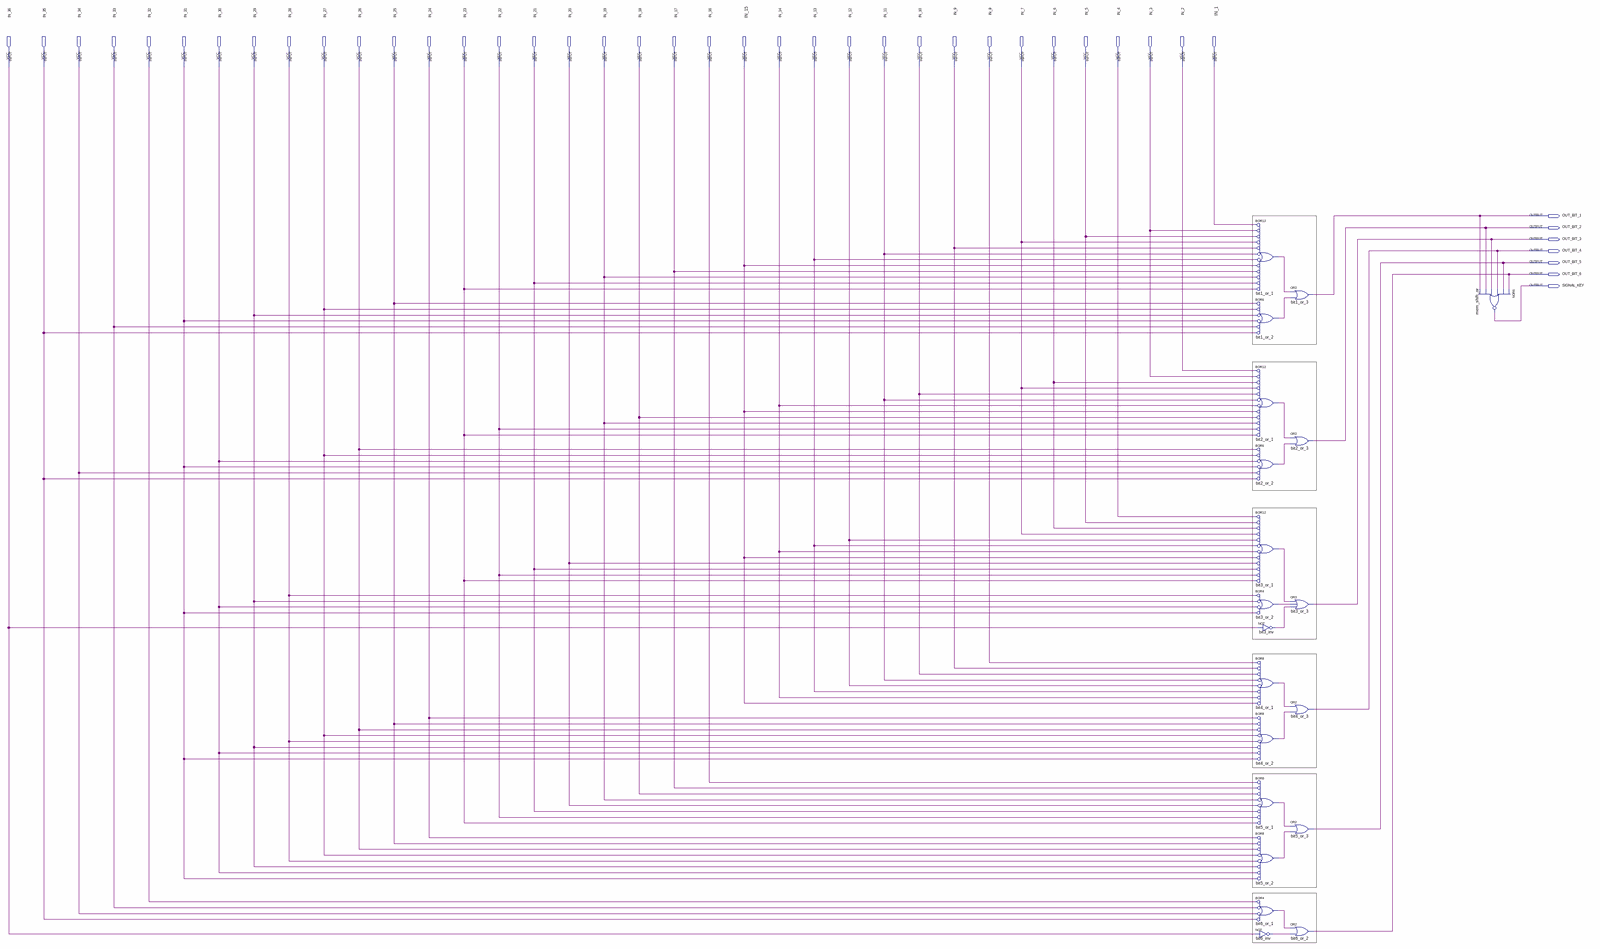
[diagram p0: schematic sheet, whole]
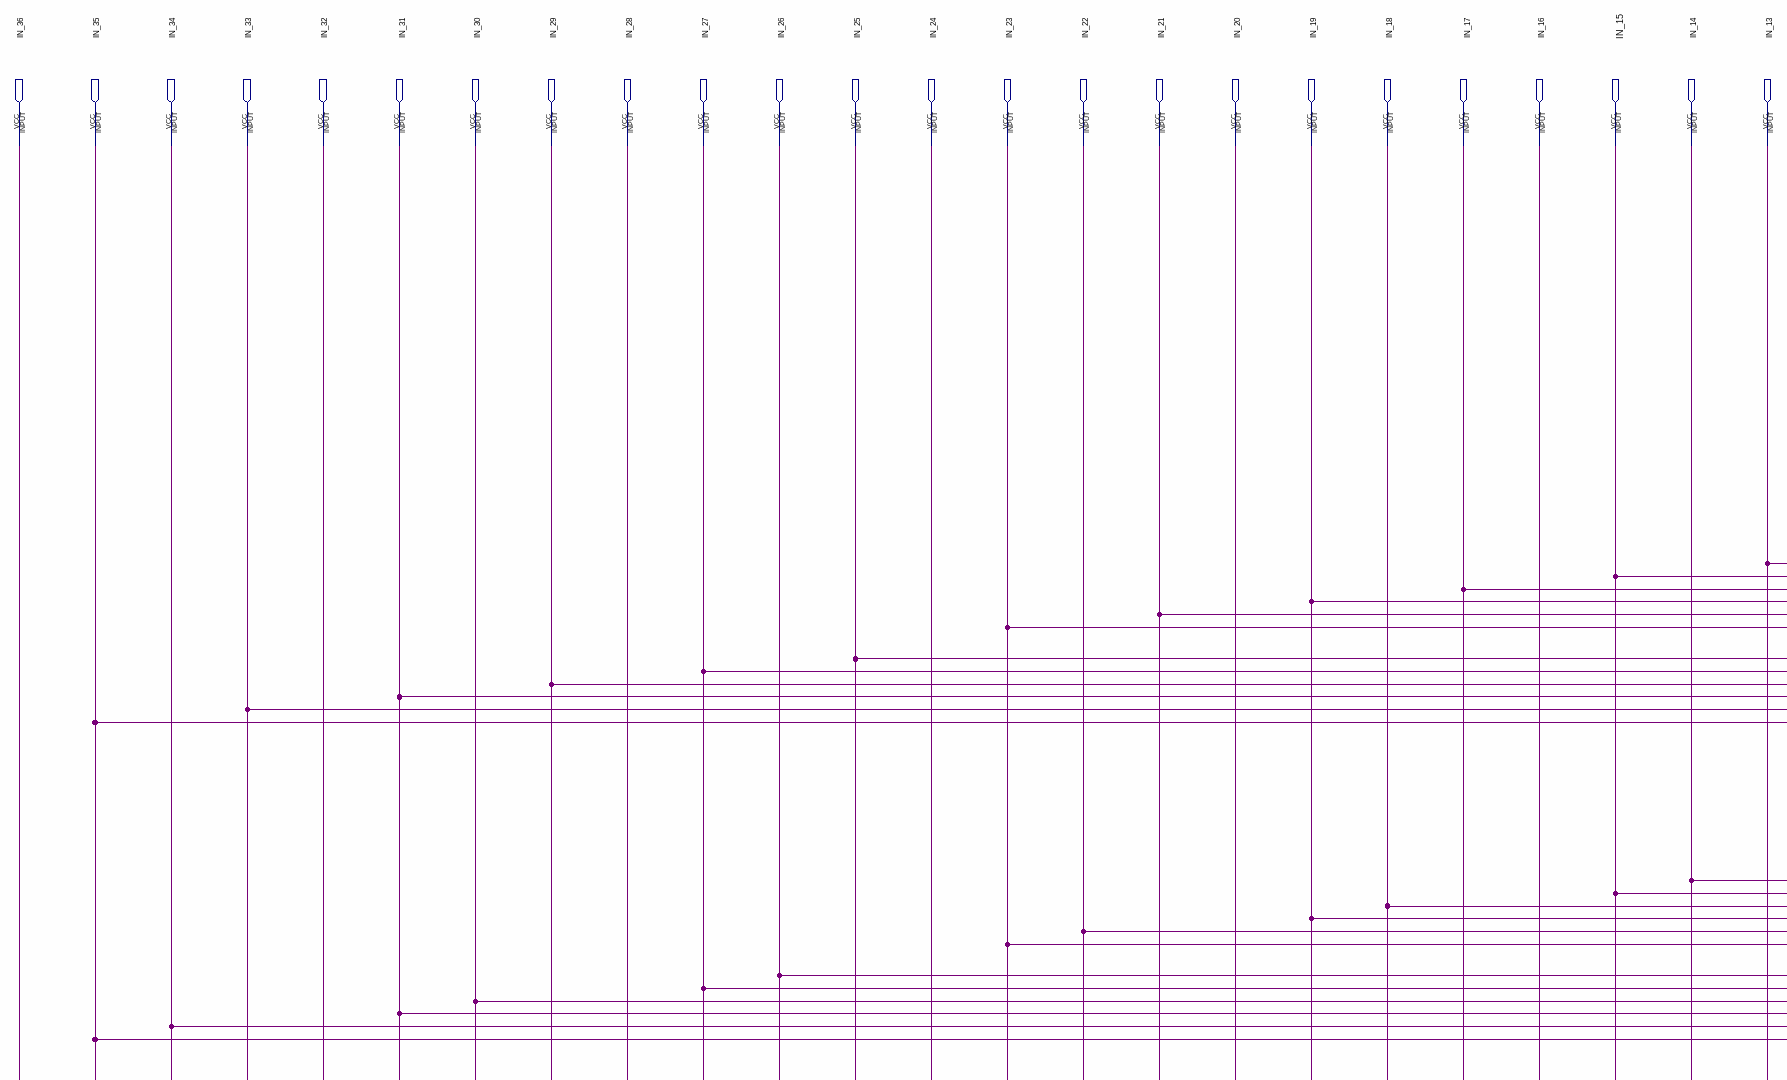
[diagram p1: schematic sheet, upper left part]
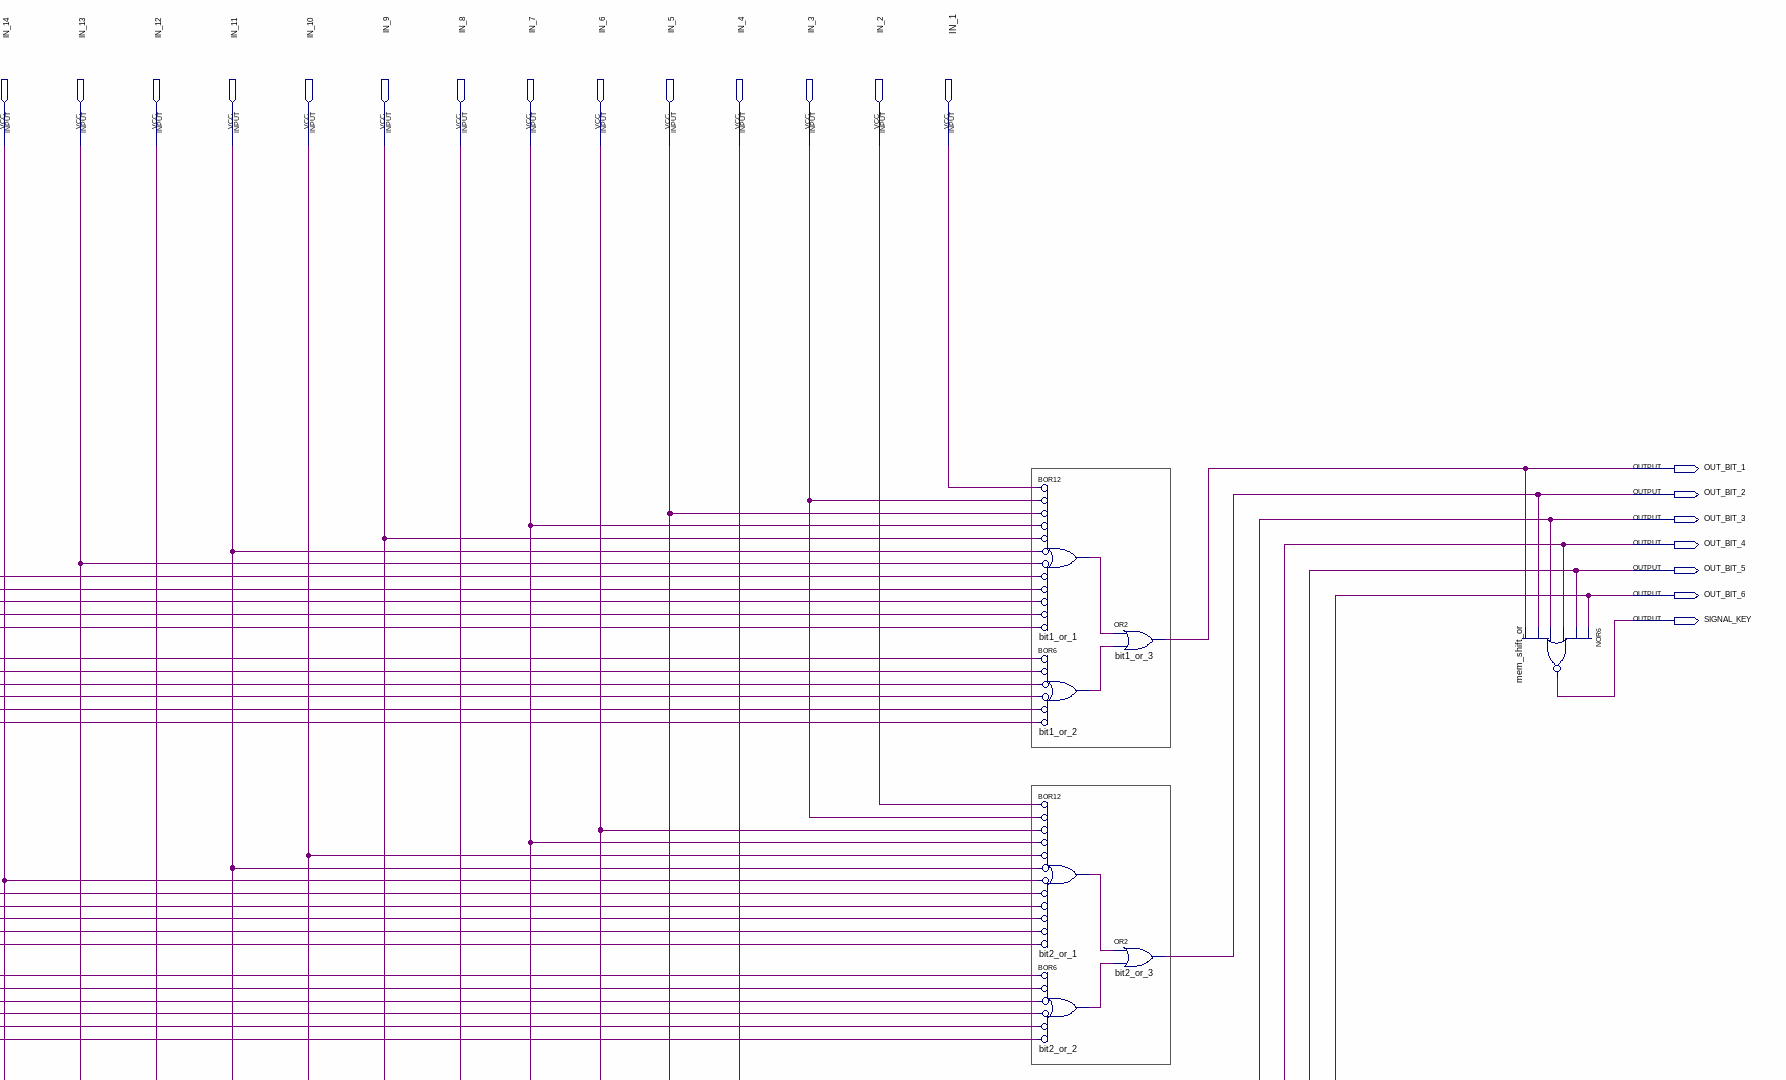
[diagram p2: schematic sheet, upper right part]
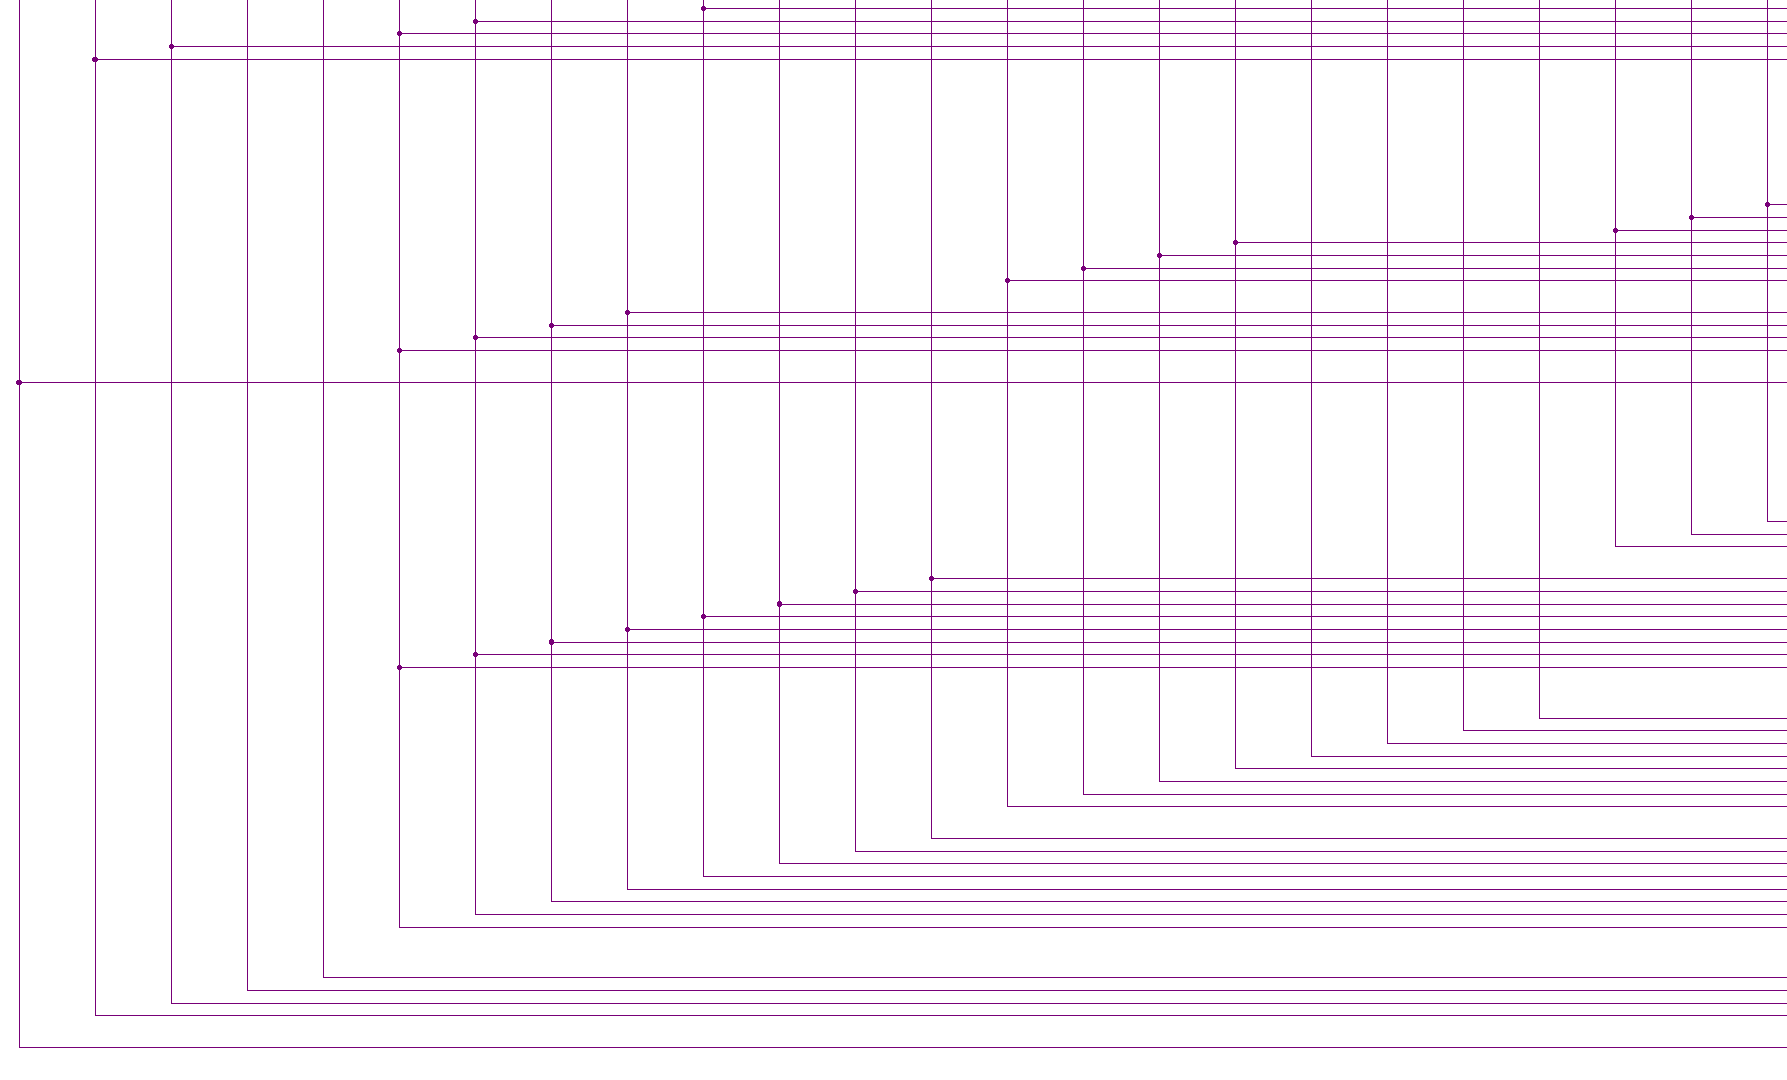
[diagram p3: schematic sheet, lower left part]
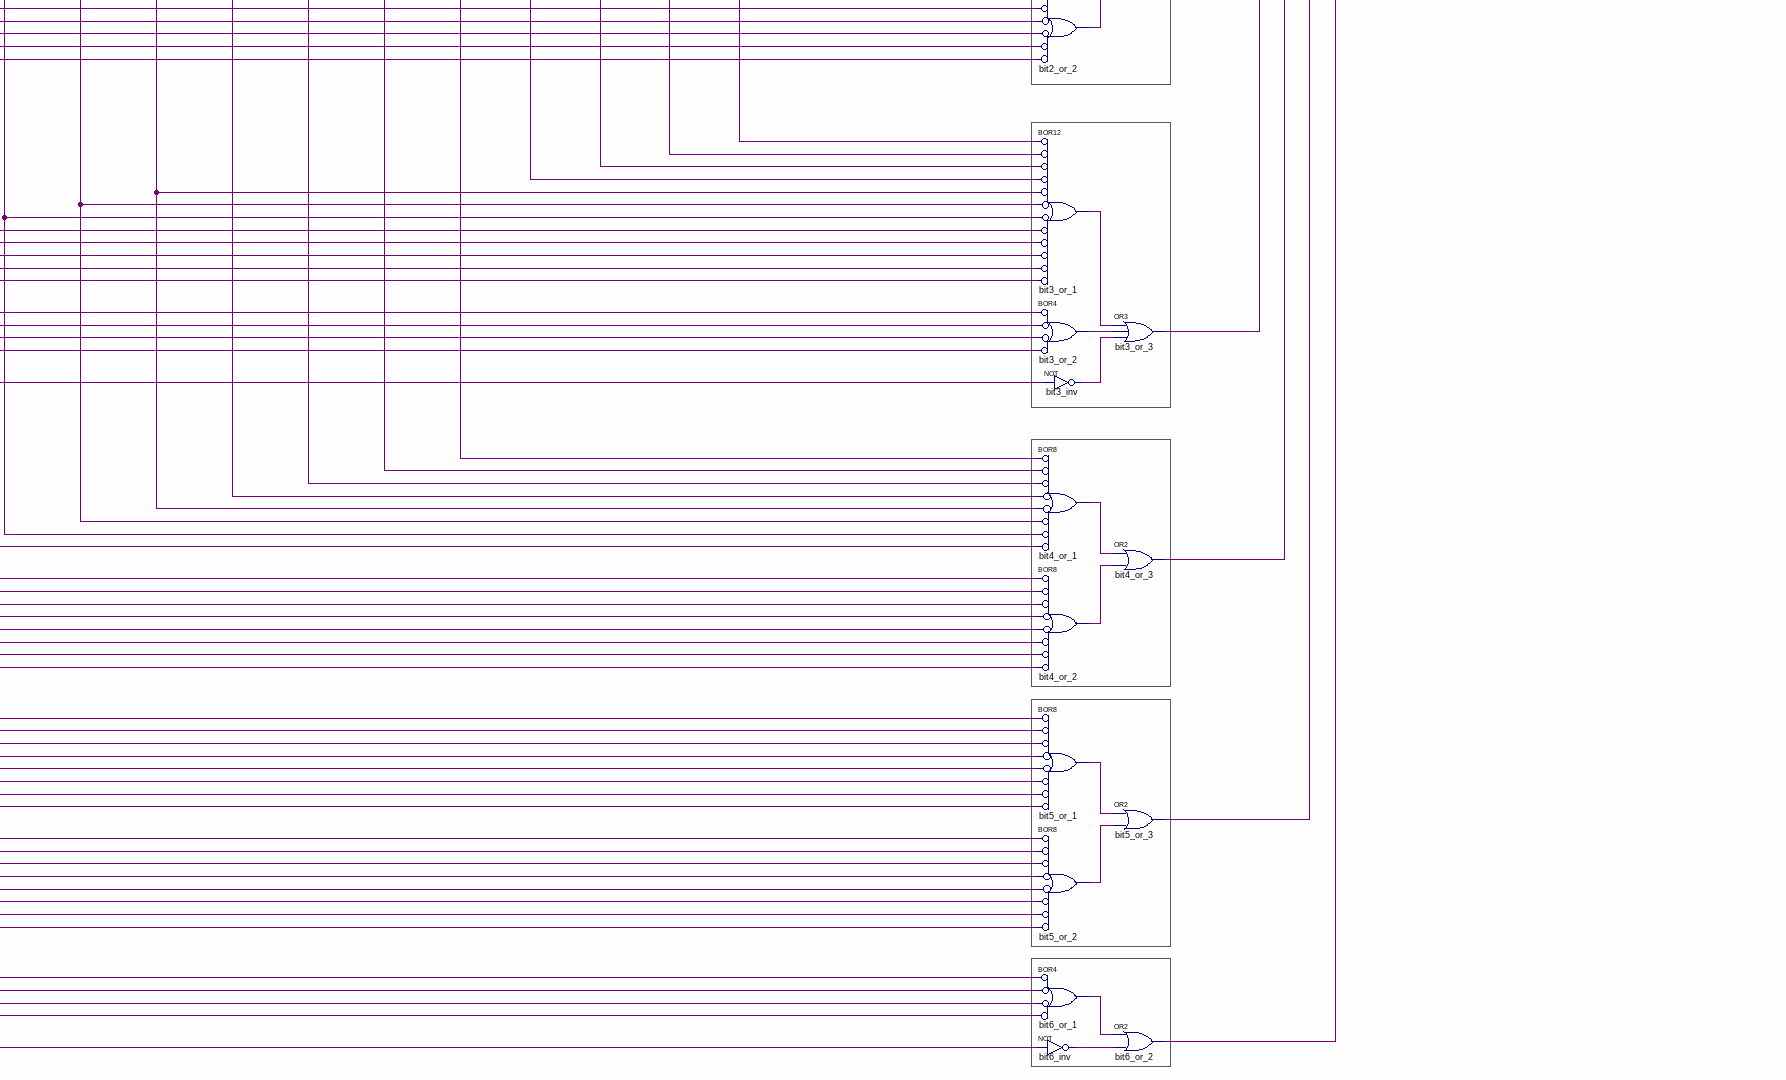
[diagram p4: schematic sheet, lower right part]
// Quartus schematic encoder.bdf as structural Verilog: 20 symbols, 43 pins
module encoder (
  input  IN_36,
  input  IN_35,
  input  IN_34,
  input  IN_33,
  input  IN_32,
  input  IN_31,
  input  IN_30,
  input  IN_29,
  input  IN_28,
  input  IN_27,
  input  IN_26,
  input  IN_25,
  input  IN_24,
  input  IN_23,
  input  IN_22,
  input  IN_21,
  input  IN_20,
  input  IN_19,
  input  IN_18,
  input  IN_17,
  input  IN_16,
  input  IN_15,
  input  IN_14,
  input  IN_13,
  input  IN_12,
  input  IN_11,
  input  IN_10,
  input  IN_9,
  input  IN_8,
  input  IN_7,
  input  IN_6,
  input  IN_5,
  input  IN_4,
  input  IN_3,
  input  IN_2,
  input  IN_1,
  output OUT_BIT_1,
  output OUT_BIT_2,
  output OUT_BIT_3,
  output OUT_BIT_4,
  output OUT_BIT_5,
  output OUT_BIT_6,
  output SIGNAL_KEY
);

  wire bit1_or_1_out, bit1_or_2_out, bit2_or_1_out, bit2_or_2_out, bit3_inv_out, bit3_or_1_out,
       bit3_or_2_out, bit4_or_1_out, bit4_or_2_out, bit5_or_1_out, bit5_or_2_out, bit6_inv_out, bit6_or_1_out;

  or bit1_or_1 (bit1_or_1_out, ~IN_1, ~IN_3, ~IN_5, ~IN_7, ~IN_9, ~IN_11, ~IN_13, ~IN_15, ~IN_17, ~IN_19, ~IN_21, ~IN_23);  // BOR12
  or bit1_or_2 (bit1_or_2_out, ~IN_25, ~IN_27, ~IN_29, ~IN_31, ~IN_33, ~IN_35);  // BOR6
  or bit2_or_1 (bit2_or_1_out, ~IN_2, ~IN_3, ~IN_6, ~IN_7, ~IN_10, ~IN_11, ~IN_14, ~IN_15, ~IN_18, ~IN_19, ~IN_22, ~IN_23);  // BOR12
  or bit2_or_2 (bit2_or_2_out, ~IN_26, ~IN_27, ~IN_30, ~IN_31, ~IN_34, ~IN_35);  // BOR6
  or bit3_or_1 (bit3_or_1_out, ~IN_4, ~IN_5, ~IN_6, ~IN_7, ~IN_12, ~IN_13, ~IN_14, ~IN_15, ~IN_20, ~IN_21, ~IN_22, ~IN_23);  // BOR12
  or bit3_or_2 (bit3_or_2_out, ~IN_28, ~IN_29, ~IN_30, ~IN_31);  // BOR4
  not bit3_inv (bit3_inv_out, IN_36);
  or bit4_or_1 (bit4_or_1_out, ~IN_8, ~IN_9, ~IN_10, ~IN_11, ~IN_12, ~IN_13, ~IN_14, ~IN_15);  // BOR8
  or bit4_or_2 (bit4_or_2_out, ~IN_24, ~IN_25, ~IN_26, ~IN_27, ~IN_28, ~IN_29, ~IN_30, ~IN_31);  // BOR8
  or bit5_or_1 (bit5_or_1_out, ~IN_16, ~IN_17, ~IN_18, ~IN_19, ~IN_20, ~IN_21, ~IN_22, ~IN_23);  // BOR8
  or bit5_or_2 (bit5_or_2_out, ~IN_24, ~IN_25, ~IN_26, ~IN_27, ~IN_28, ~IN_29, ~IN_30, ~IN_31);  // BOR8
  or bit6_or_1 (bit6_or_1_out, ~IN_32, ~IN_33, ~IN_34, ~IN_35);  // BOR4
  not bit6_inv (bit6_inv_out, IN_36);
  or bit1_or_3 (OUT_BIT_1, bit1_or_1_out, bit1_or_2_out);
  or bit2_or_3 (OUT_BIT_2, bit2_or_1_out, bit2_or_2_out);
  or bit3_or_3 (OUT_BIT_3, bit3_or_1_out, bit3_or_2_out, bit3_inv_out);
  or bit4_or_3 (OUT_BIT_4, bit4_or_1_out, bit4_or_2_out);
  or bit5_or_3 (OUT_BIT_5, bit5_or_1_out, bit5_or_2_out);
  or bit6_or_2 (OUT_BIT_6, bit6_or_1_out, bit6_inv_out);
  nor mem_shift_or (SIGNAL_KEY, OUT_BIT_6, OUT_BIT_5, OUT_BIT_4, OUT_BIT_3, OUT_BIT_2, OUT_BIT_1);
endmodule
